# EAGLE design schematic (EAGLE 6.2)
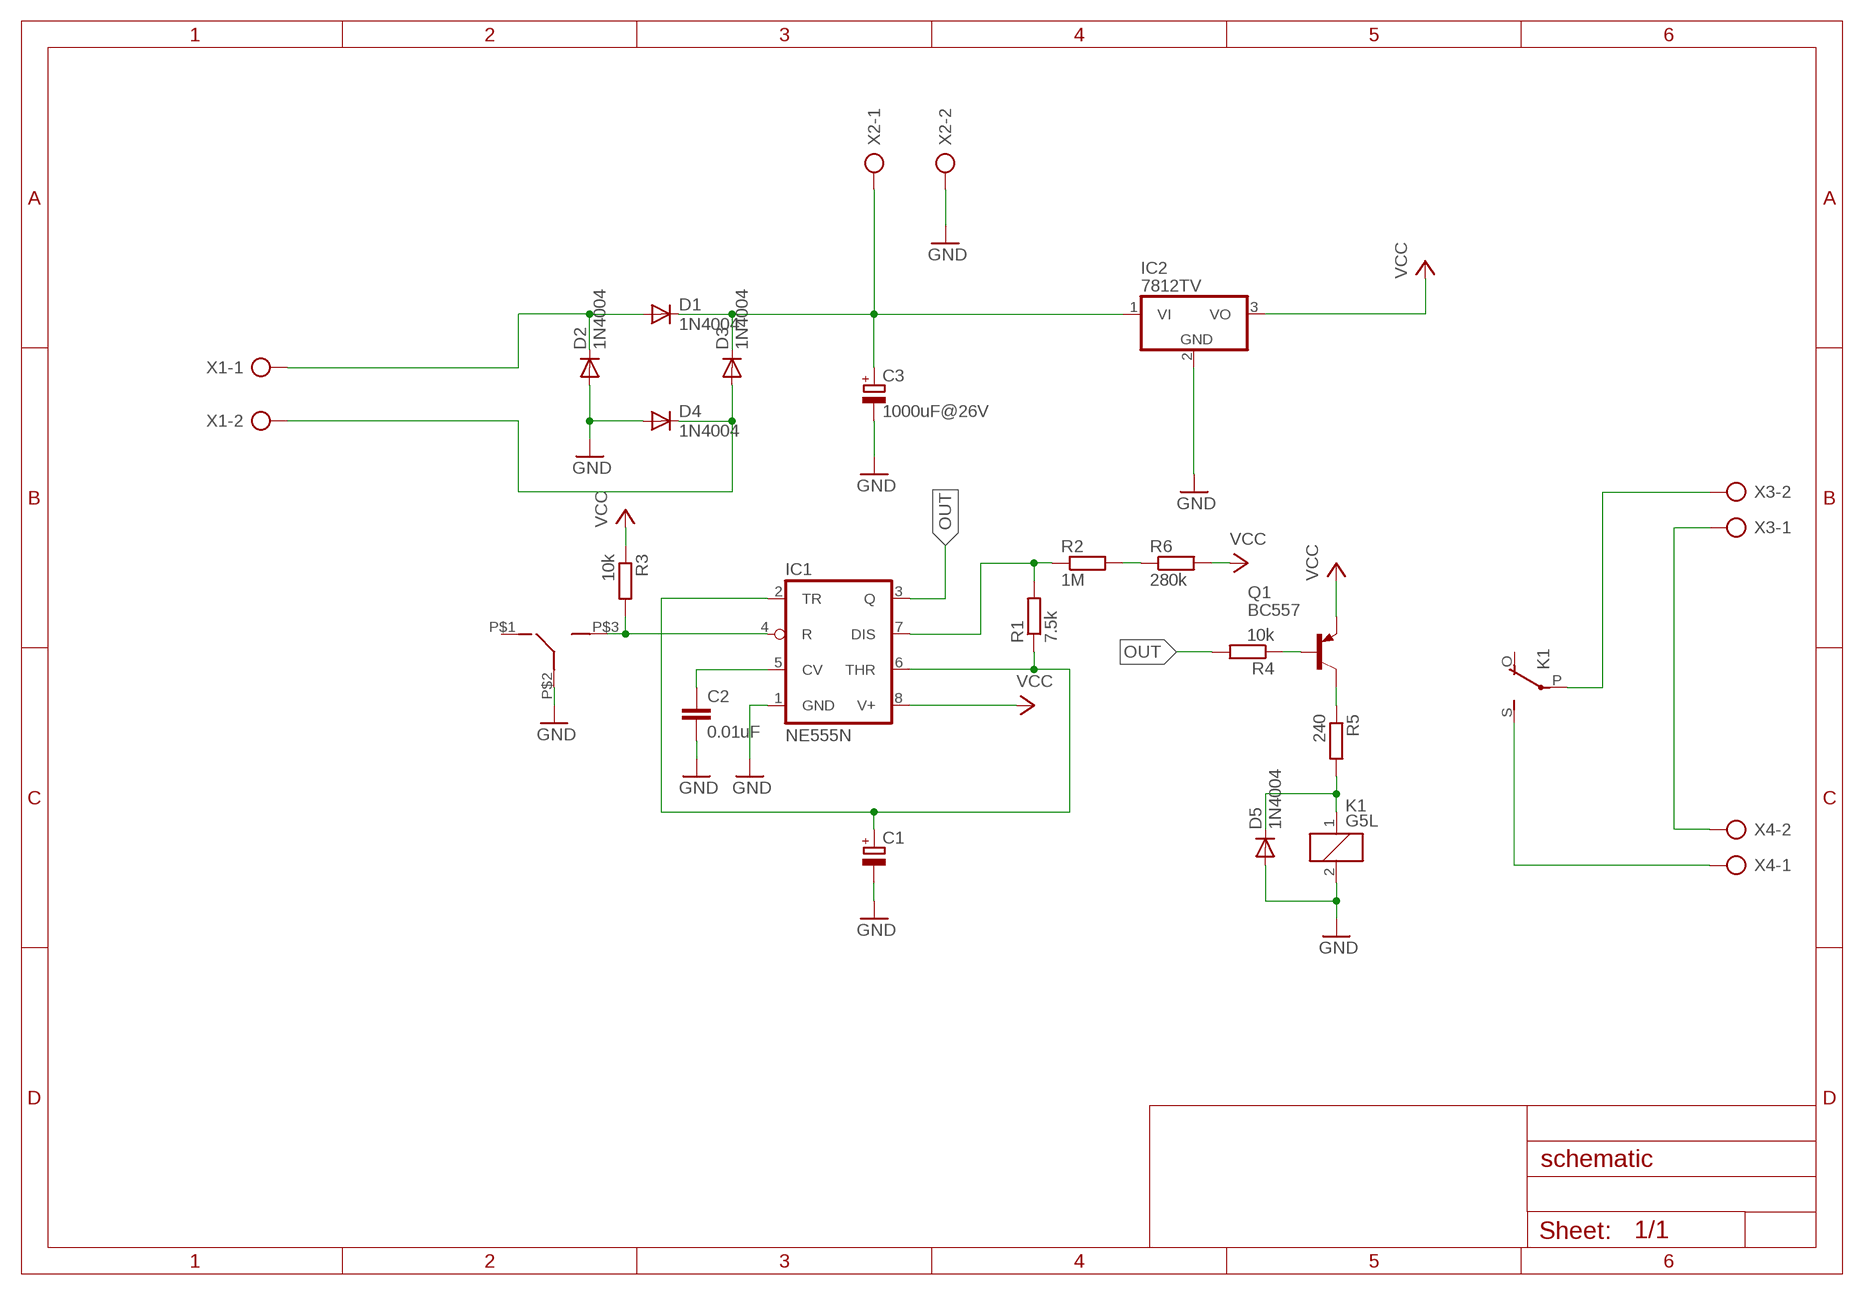
[diagram p0: schematic, sheet 1]

## Parts
C1  CPOL-EUE5-13  [E5-13]
C2  0.01uF  C-EU025-025X050  [C025-025X050]
C3  1000uF@26V  CPOL-EUE5-13  [E5-13]
D1  1N4004  [DO41-10]
D2  1N4004  [DO41-10]
D3  1N4004  [DO41-10]
D4  1N4004  [DO41-10]
D5  1N4004  [DO41-10]
IC1  NE555N  [DIL08]
IC2  7812TV  [TO220V]
K1  G5L  [G5LE]
Q1  BC557  [TO92]
R1  7.5k  R-EU_0207/7  [0207/7]
R2  1M  R-EU_0207/7  [0207/7]
R3  10k  R-EU_0207/7  [0207/7]
R4  10k  R-EU_0207/7  [0207/7]
R5  240  R-EU_0207/7  [0207/7]
R6  280k  R-EU_0207/7  [0207/7]
SW1  SWITCH  [SWITCH]
X1  AK500/2  [AK500/2]
X2  AK500/2  [AK500/2]
X3  AK500/2  [AK500/2]
X4  AK500/2  [AK500/2]

## Nets
18VRMS_F: D1.A D2.C X1.1
18VRMS_N: D3.A D4.C X1.2
GND: C1.- C2.2 C3.- D2.A D4.A D5.A IC1.1(GND) IC2.2(GND) K1.2 SW1.P$2 X2.2
N$1: R2.2 R6.1
N$2: Q1.2(B) R4.1
N$4: C3.+ D1.C D3.C IC2.1(VI) X2.1
N$5: C1.+ IC1.2(TR) IC1.6(THR) R1.1
N$6: IC1.7(DIS) R1.2 R2.1
N$7: IC1.4(R) R3.2 SW1.P$3
N$8: C2.1 IC1.5(CV)
N$9: K1.S(2:S) X4.1
N$10: Q1.3(C) R5.1
N$11: D5.C K1.1 R5.2
N$12: X3.1 X4.2
N$13: K1.P(2:P) X3.2
OUT: IC1.3(Q) R4.2
VCC: IC1.8(V+) IC2.3(VO) Q1.1(E) R3.1 R6.2
Unconnected: K1.O(2:O) SW1.P$1

## Library data of the parts
C1 C3 = rcl:CPOL-EU: POLARIZED CAPACITOR, European symbol
C2 = rcl:C-EU: CAPACITOR, European symbol
D1-D5 = diode:1N4004: DIODE general purpose rectifier, 1 A
IC1 = linear:*555: TIMER
IC2 = linear:78*: Positive VOLTAGE REGULATOR Source: http://cache.national.com/ds/LM/LM78L05.pdf http://www.fairchildsemi.com/ds/LM/LM7805.pdf
K1 = relay:G5L: RELAY 1 x switch, 10 A/120 V AC, 8 A/30 V ADC, Omron; OC_FARNELL: unknown; OC_NEWARK: unknown
Q1 = transistor-pnp:BC557: PNP Transistor
R1-R6 = rcl:R-EU_: RESISTOR, European symbol
SW1 = MechanicalSwitch:SWITCH
X1-X4 = con-ptr500:AK500/2: CONNECTOR; OC_FARNELL: unknown; OC_NEWARK: unknown

## Board
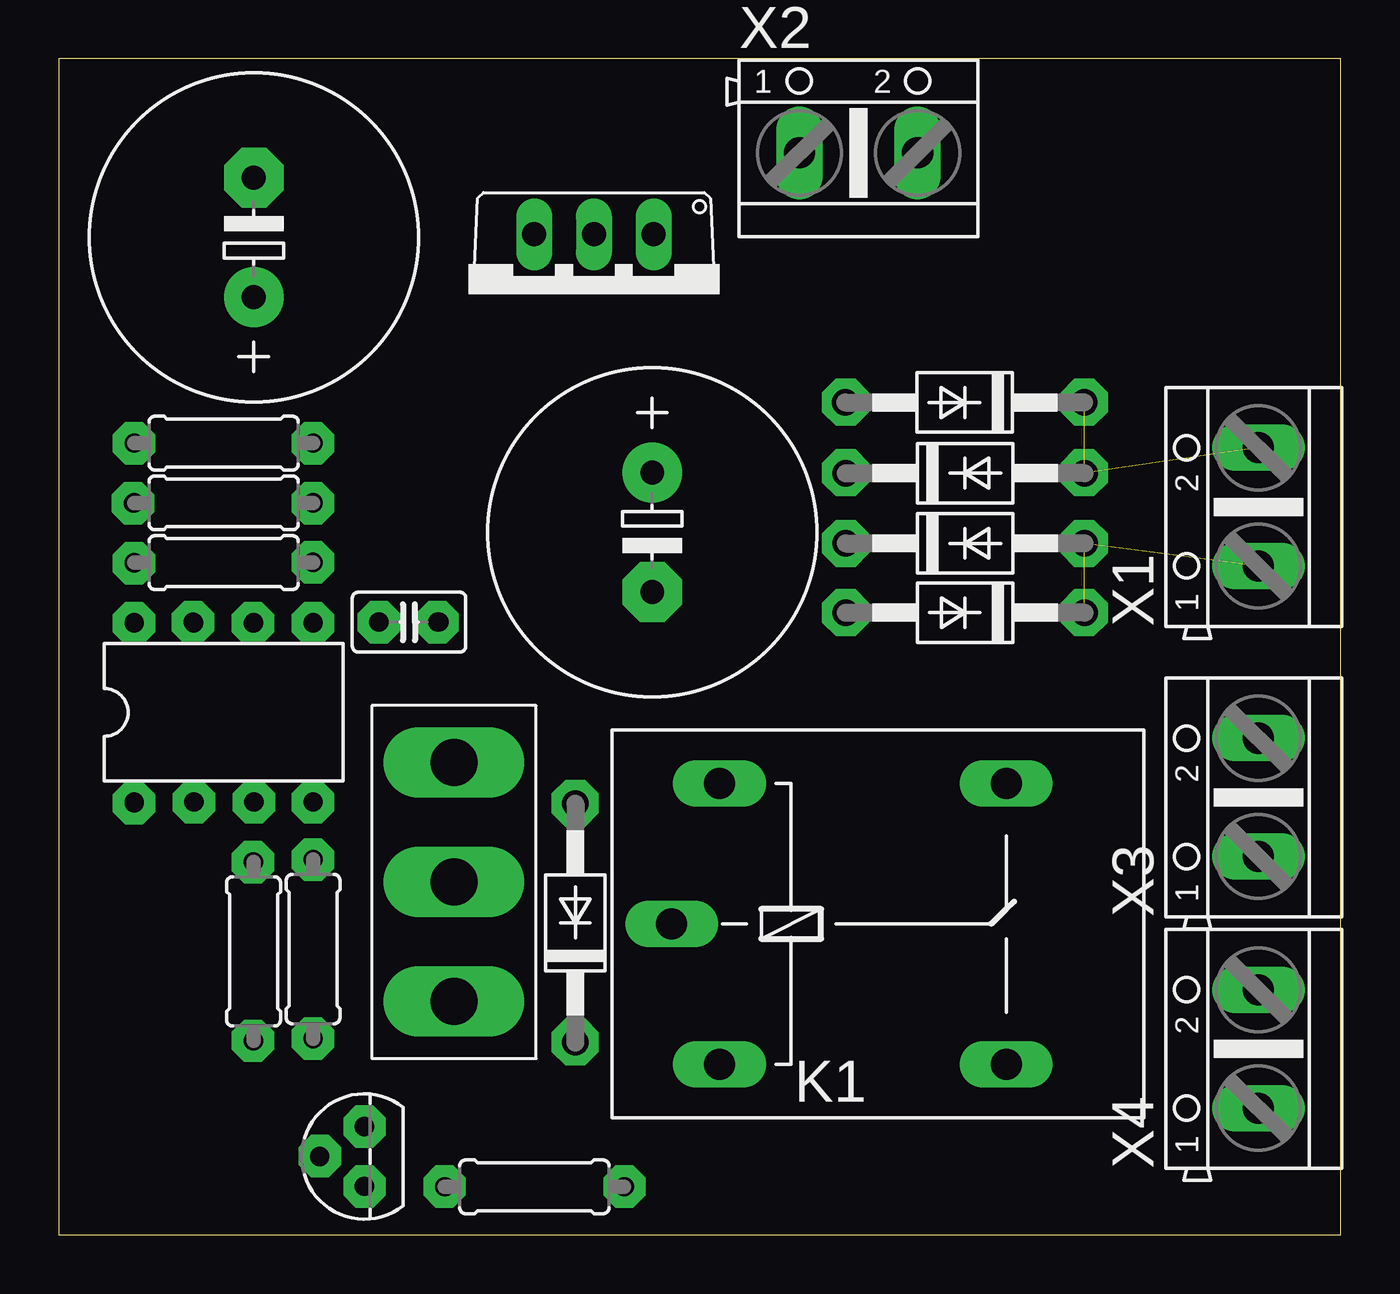
[diagram p1: board, top side]
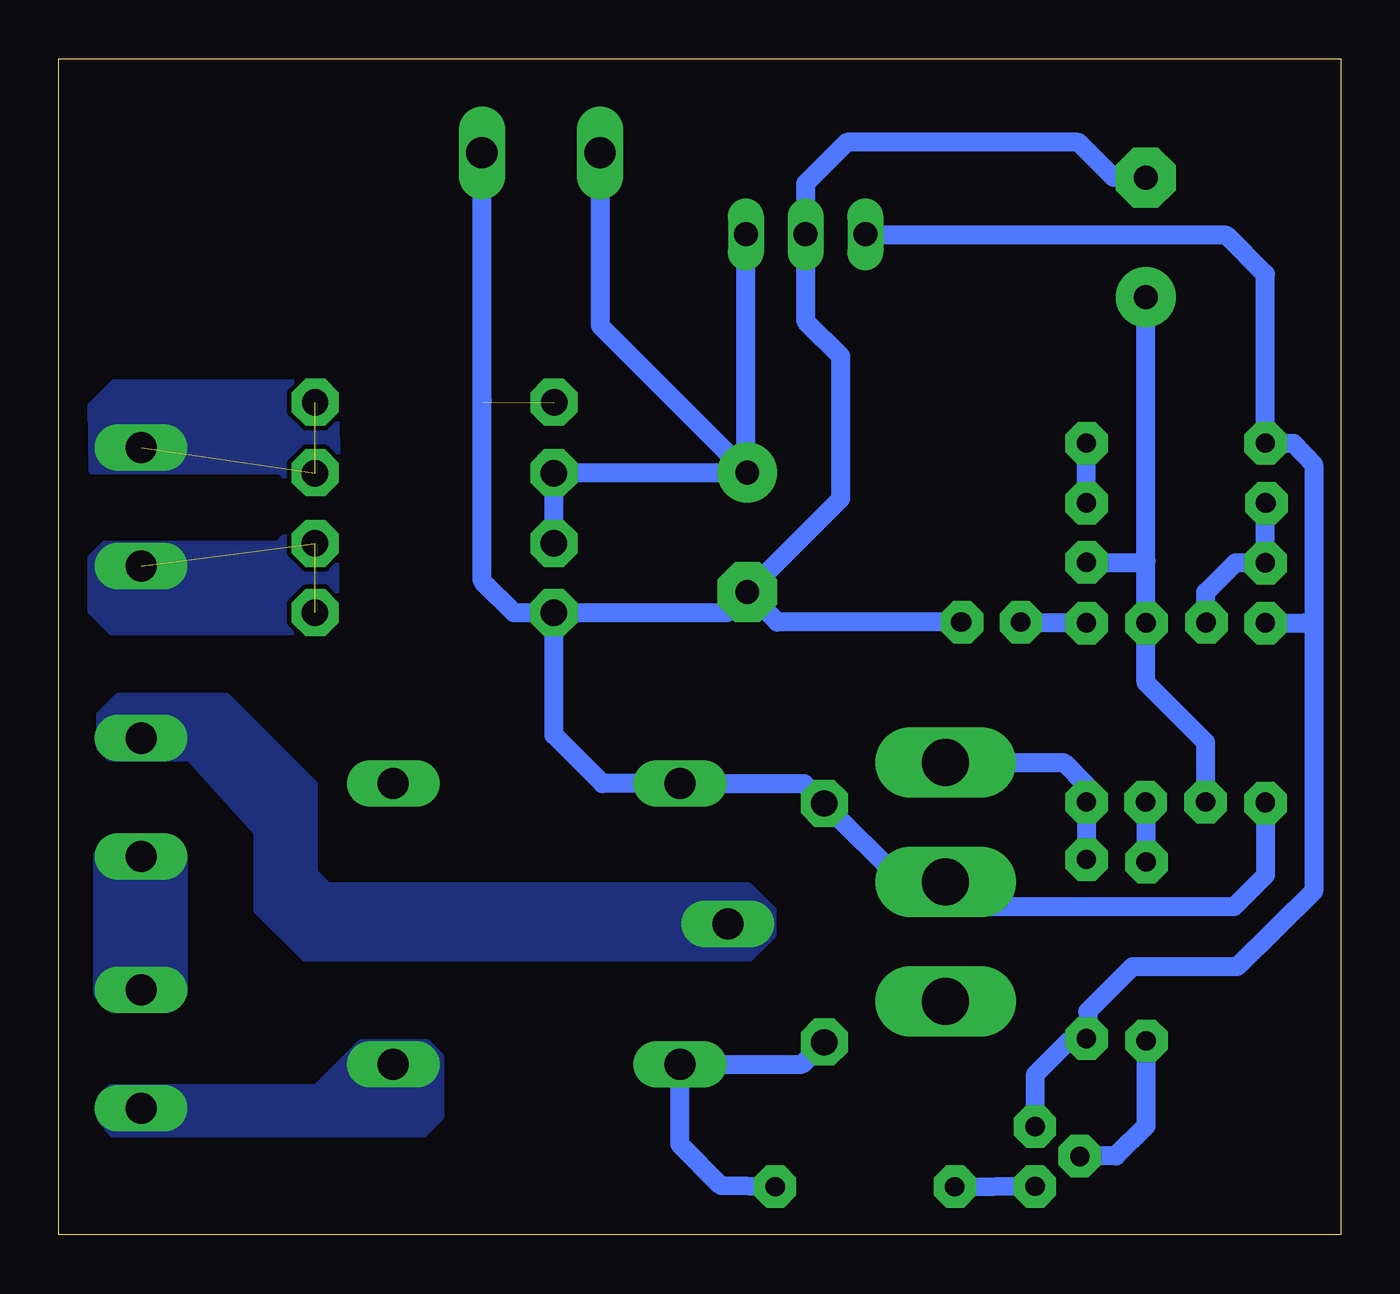
[diagram p2: board, bottom side, seen from below]

Size 54.5 x 50 mm. Coordinates in mm from the lower left corner, seen from the top.
Outline: 0,0 54.5,0 54.5,50 0,50 0,0
Copper layers (1*16): Top 0.035mm / dielectric 1.5mm / Bottom 0.035mm
Design rules: minimum track width 10mil, minimum drill 24mil, track to track 8mil, track to pad 8mil, pad to pad 8mil, via to via 8mil, smd to smd 8mil, copper to edge 40mil, drill to drill 8mil, minimum pad ring 10mil, minimum via ring 8mil, stop-mask expansion 4mil, vias tented up to drill 0mil, thermal gap 10mil

### Footprints (pad centres in the part's own frame; a part is rotated, then mirrored left to right if it is on the bottom)
E5-13 = drill 1.016 pad 2.54: + -2.54,0 | drill 1.016 pad 2.54 octagon: - 2.54,0
C025-025X050 = drill 0.813 octagon: 1 -1.27,0; 2 1.27,0
DO41-10 = drill 1.118: A 5.08,0; C -5.08,0
DIL08 = drill 0.813 pad 1.27: 1 -3.81,-3.81; 2 -1.27,-3.81; 3 1.27,-3.81; 4 3.81,-3.81; 5 3.81,3.81; 6 1.27,3.81; 7 -1.27,3.81; 8 -3.81,3.81
TO220V = drill 1.016 long: 1 -2.54,-2.54; 2 0,-2.54; 3 2.54,-2.54
G5LE = drill 1.321 long: 1 -7.493,-5.969; 2 -7.493,5.969; O 4.699,5.969; P -9.525,0; S 4.699,-5.969
TO92 = drill 0.813 octagon: 1 1.27,0; 2 0,1.905; 3 -1.27,0
0207/7 = drill 0.813 octagon: 1 -3.81,0; 2 3.81,0
SWITCH = drill 2 long: P$1 -5.08,0; P$2 0,0; P$3 5.08,0
AK500/2 = drill 1.321 long: 1 -2.515,0; 2 2.515,0

### Placement (x,y rotation side)
C1  8.29,42.41 90 top
C2  14.89,26.05 0 top
C3  25.23,29.87 270 top
D1  38.53,29.4 0 top
D2  38.53,26.45 180 top
D3  38.53,32.38 0 top
D4  38.52,35.39 180 top
D5  21.96,13.26 90 top
IC1  7.01,22.21 0 top
IC2  22.75,40 180 top
K1  35.58,13.22 0 top
Q1  12.99,3.33 90 top
R1  7.01,28.58 180 top
R2  7.01,31.12 0 top
R3  10.81,12.15 90 top
R4  8.28,12.05 90 top
R5  20.22,2.04 0 top
R6  7.01,33.66 180 top
SW1  16.8,15 90 top
X1  51,30.95 90 top
X2  34,46 0 top
X3  51,18.6 90 top
X4  51,7.9 90 top

### Tracks (layer width: path | path; a pad name or v marks a point on that pad's centre or on a via)
18VRMS_F  (2 unrouted)
  pour Bottom (no thermals): 43.4,30.25 43.3,30.25 42.7,29.65 42.7,26.15 43.25,25.6 52.25,25.6 53.15,26.5 53.15,28.8 52.55,29.4 45.2,29.4 44.35,30.25 43.45,30.25
18VRMS_N  (2 unrouted)
  pour Bottom (no thermals): 43.35,31.6 44.25,31.6 45.1,32.45 53.1,32.45 53.15,35.25 52.15,36.25 43.25,36.25 42.7,35.6 42.65,32.15
GND  (via drill 0.8 pad 1.8)  (1 unrouted)
  Bottom 0.406: 36.46,35.41 36.5,35.45 | 36.5,45.98 X2.2
  Bottom 0.813: IC1.1 v3.2,18.35 3.2,15.29 4.54,13.95 15,13.95 SW1.P$2 18.62,15 D5.A 22.81,19.19 K1.2 31.39,19.19 33.45,21.25 D2.A | D2.A 35.15,26.45 36.5,27.8 36.5,35.45 36.5,45.98 | D2.A 26.11,26.45 C3.- | C1.- 9.65,44.95 11.15,46.45 21,46.45 22.75,44.7 IC2.2 22.75,38.85 21.25,37.35 21.25,31.3 23.07,29.48 C3.- | C2.2 23.95,26.05 C3.-
N$1
  Bottom 0.813: R2.2 R6.1
N$2
  Bottom 0.406: 11.06,3.35 Q1.2
  Bottom 0.813: R4.1 8.28,4.62 9.55,3.35 11.06,3.35
N$3  (via drill 0.8 pad 1.8)
  other vias: 3.2,33.65
N$4
  Bottom 0.406: 33.42,32.41 D3.C | 25.28,32.46 C3.+ | IC2.1
  Bottom 0.813: D1.C D3.C | 33.42,32.41 C3.+ | IC2.1 25.28,32.46 31.48,38.66 X2.1
N$5
  Bottom 0.406: 8.35,28.58 8.28,28.65
  Bottom 0.813: IC1.2 5.74,20.94 8.28,23.48 IC1.6 8.28,28.65 8.28,39.18 C1.+ | R1.1 8.35,28.58
N$6
  Bottom 0.813: R2.1 R1.2 4.47,28.58 5.74,27.31 IC1.7
N$7
  Bottom 0.406: 10.85,19.15 10.85,18.43 IC1.4
  Bottom 0.813: IC1.4 R3.2 | SW1.P$3 11.78,20.08 10.85,19.15
N$8
  Bottom 0.406: 13.59,26.02 C2.1
  Bottom 0.813: IC1.5 13.59,26.02
N$9
  pour Bottom (no thermals): 52.3,6.3 43.55,6.3 41.65,8.2 38.85,8.2 38.25,7.6 38.25,5 39,4.25 52.2,4.25 52.75,4.9 52.7,5.9
N$10
  Bottom 0.406: 13.02,2.09 Q1.3
  Bottom 0.813: R5.1 13.02,2.09
N$11
  Bottom 0.406: 28.1,7.24 K1.1
  Bottom 0.813: R5.2 26.34,2.09 28.1,3.85 28.1,7.24 | K1.1 22.89,7.25 D5.C
N$12
  pour Bottom (no thermals): 49.15,16.05 49.15,10.2 49.2,10.2 49.85,9.55 52.25,9.55 52.9,10.2 52.9,16.2 52.15,16.95 50,16.95 49.15,16.1
N$13
  pour Bottom (no thermals): 52.35,20.25 48.95,20.25 46.1,17.1 46.1,13.8 44.05,11.75 25.1,11.75 24.1,12.75 24.1,13.8 25.15,14.85 43.05,14.85 43.6,15.4 43.6,19.15 47.35,22.9 52,22.9 52.8,22.1 52.8,20.7
N$14  (via drill 0.8 pad 1.8)
  other vias: 3.15,31.1
N$15  (via drill 0.8 pad 1.8)
  other vias: 3.2,28.55
N$16  (via drill 0.8 pad 1.8)
  other vias: 10.8,28.6
N$17  (via drill 0.8 pad 1.8)
  other vias: 10.8,31.1
N$18  (via drill 0.8 pad 1.8)
  other vias: 10.8,33.65
N$19  (via drill 0.8 pad 1.8)
  other vias: 13.6,26.05
N$20  (via drill 0.8 pad 1.8)
  other vias: 16.1,26.05
N$21  (via drill 0.8 pad 1.8)
  other vias: 10.8,26
N$22  (via drill 0.8 pad 1.8)
  other vias: 3.2,26
N$23  (via drill 0.8 pad 1.8)
  other vias: 5.7,26.05
N$24  (via drill 0.8 pad 1.8)
  other vias: 8.25,26
N$25  (via drill 0.8 pad 1.8)
  other vias: 5.75,18.4
N$26  (via drill 0.8 pad 1.8)
  other vias: 8.3,18.4
N$27  (via drill 0.8 pad 1.8)
  other vias: 10.8,18.4
N$28  (via drill 0.8 pad 1.8)
  other vias: 8.25,15.85
N$29  (via drill 0.8 pad 1.8)
  other vias: 10.8,15.95
N$30  (via drill 0.8 pad 1.8)
  other vias: 8.25,8.25
N$31  (via drill 0.8 pad 1.8)
  other vias: 10.8,8.35
N$32  (via drill 0.8 pad 1.8)
  other vias: 13,4.6
N$33  (via drill 0.8 pad 1.8)
  other vias: 11.1,3.35
N$34  (via drill 0.8 pad 1.8)
  other vias: 13,2.05
N$35  (via drill 0.8 pad 1.8)
  other vias: 16.4,2.05
N$36  (via drill 0.8 pad 1.8)
  other vias: 24.05,2.05
N$37  (via drill 1 pad 2)
  other vias: 21.95,8.2
N$38  (via drill 1 pad 2)
  other vias: 21.95,18.35
N$39  (via drill 1 pad 2)
  other vias: 43.6,35.4
N$40  (via drill 1 pad 2)
  other vias: 43.6,32.4
N$41  (via drill 1 pad 2)
  other vias: 43.6,29.4
N$42  (via drill 1 pad 2)
  other vias: 43.6,26.45
N$43  (via drill 1 pad 2)
  other vias: 33.45,26.45
N$44  (via drill 1 pad 2)
  other vias: 33.45,29.4
N$45  (via drill 1 pad 2)
  other vias: 33.45,32.4
N$46  (via drill 1 pad 2)
  other vias: 33.45,35.4
OUT
  Bottom 0.813: IC1.3 R4.2
VCC
  Bottom 0.406: Q1.1 | 10.75,8.35 R3.1 | 1.53,26.02 1.15,26.1 | 20.3,42.5 IC2.3
  Bottom 0.813: R3.1 11.56,8.24 13,6.8 Q1.1 | 10.75,8.35 10.75,9.5 8.85,11.4 4.4,11.4 1.15,14.6 1.15,26.1 1.15,32.75 2.01,33.66 R6.2 3.2,40.85 4.85,42.5 20.3,42.5 | IC1.8 1.53,26.02